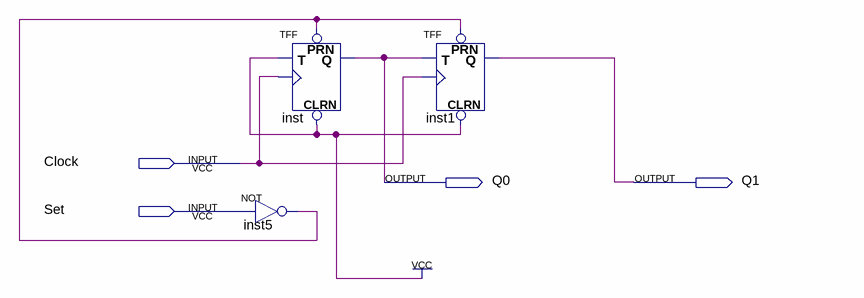
[diagram p0: schematic sheet]
// Quartus schematic 2bit_counter.bdf as structural Verilog: 3 symbols, 4 pins
module \2bit_counter  (
  input  Clock,
  input  Set,
  output Q0,
  output Q1
);

  wire inst5_out;

  not inst5 (inst5_out, Set);
  TFF inst (.PRN(inst5_out), .CLRN(1'b1), .T(1'b1), .CLK(Clock), .Q(Q0));
  TFF inst1 (.PRN(inst5_out), .CLRN(1'b1), .T(Q0), .CLK(Clock), .Q(Q1));
endmodule
